# Altium schematic sheet Power supplies.SchDoc
size A4; Author: T. Kreppel; CompanyName: Universidad de Santiago de Chile; Address1: Avenida Ecuador Nº 3519; Address2: Estación Central, Santiago; Address3: Chile; DocumentNumber: 5; SheetNumber: 5; SheetTotal: 5
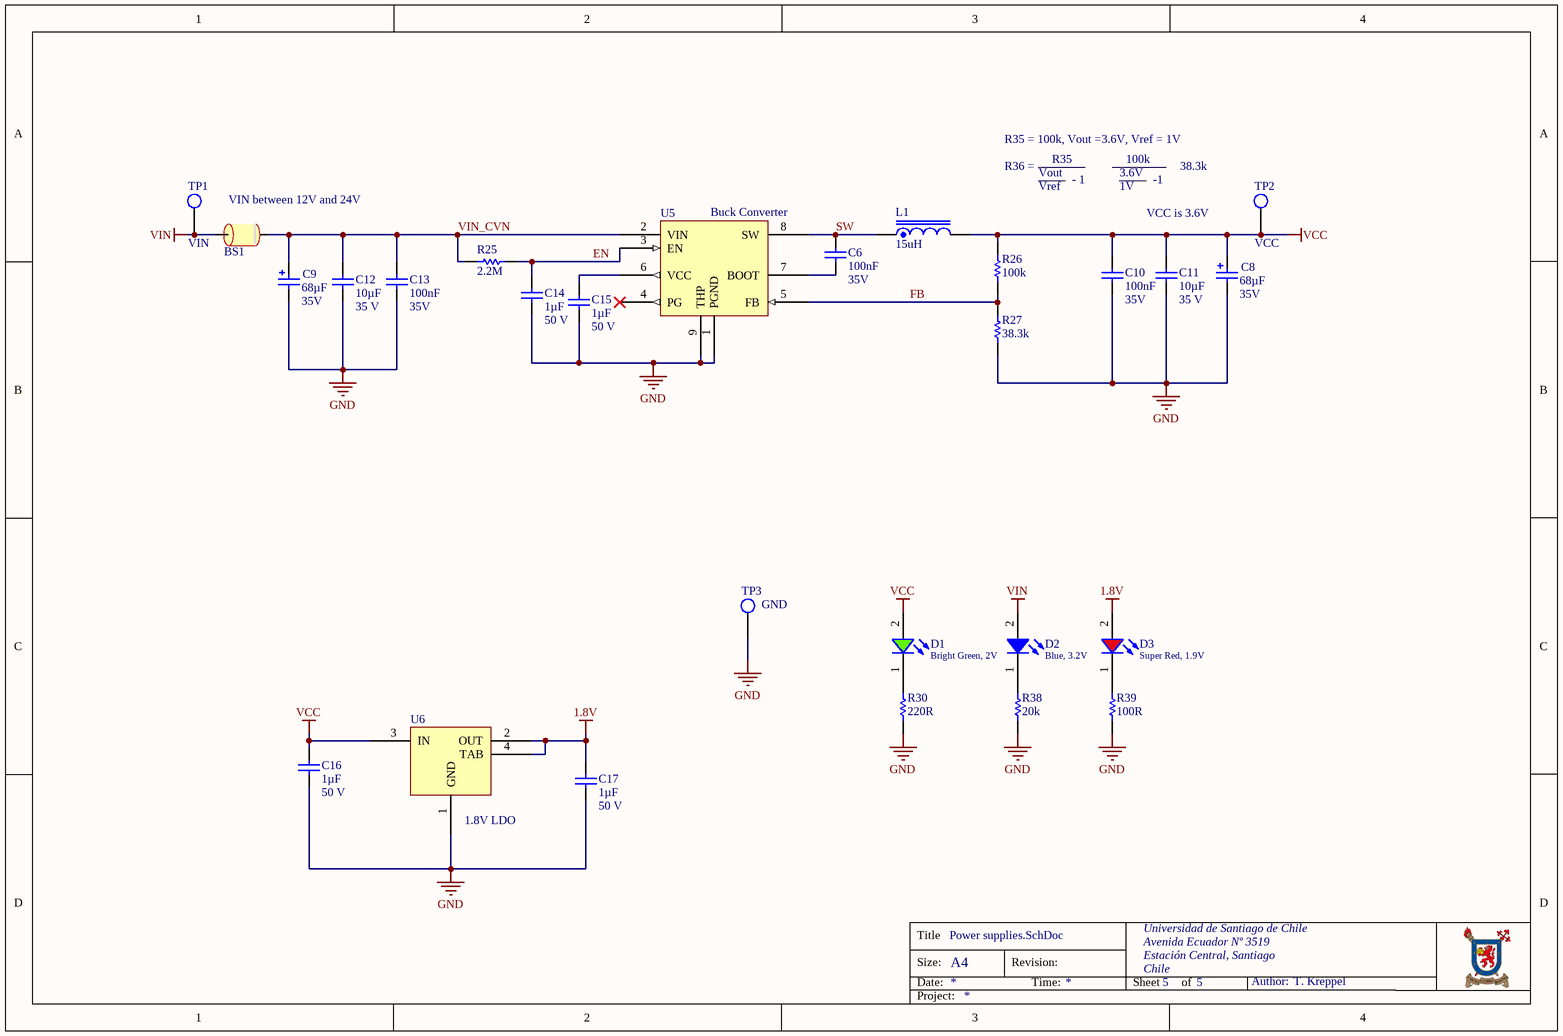
[diagram p0: Power supplies.SchDoc]

## Parts
BS1  Ferrite bead  [RES_1206]  (value not drawn)
C6  100nF  Voltage: 35V  [CAP_0603]
C8  68µF  Voltage: 35V  [WCAP-ATG8_6.3x11]
C9  68µF  Voltage: 35V  [WCAP-ATG8_6.3x11]
C10  100nF  Voltage: 35V  [CAP_0603]
C11  10µF  Voltage: 35 V  [RES_1206]
C12  10µF  Voltage: 35 V  [RES_1206]
C13  100nF  Voltage: 35V  [CAP_0603]
C14  1µF  Voltage: 50 V  [CAP_0603]
C15  1µF  Voltage: 50 V  [CAP_0603]
C16  1µF  Voltage: 50 V  [CAP_0603]
C17  1µF  Voltage: 50 V  [CAP_0603]
D1  Bright Green, 2V  [WL-SMCW_0603_H=0.7mm]
D2  Blue, 3.2V  [WL-SMCW_0603_H=0.7mm]
D3  Super Red, 1.9V  [WL-SMCW_0603_H=0.7mm]
L1  15uH  [SMT_inductor_1050_Performance]
R25  2.2M  [RES_0603]
R26  100k  [RES_0603]
R27  38.3k  [RES_0603]
R30  220R  [RES_0603]
R38  20k  [RES_0603]
R39  100R  [RES_0603]
TP1  VIN  [TP_1.6mm]  (no BOM)
TP2  VCC  [TP_1.6mm]  (no BOM)
TP3  GND  [TP_1.6mm]  (no BOM)
U5  Buck Converter  [SOIC127P600X170_HS-9N]
U6  1.8V LDO  [SOT230P700X170-4N]

## Nets
1.8V: C17.1 D3.2(A) U6.2(OUT) U6.4(TAB)
GND: C8.1(N) C9.1(N) C10.2 C11.2 C12.2 C13.2 C14.2 C15.2 C16.2 C17.2 R27.1 R30.1 R38.2 R39.2 TP3.1 U5.1(PGND) U5.9(THP) U6.1(GND)
VCC: C8.2(P) C10.1 C11.1 C16.1 D1.2(A) L1.2 R26.2 TP2.1 U6.3(IN)
VIN: BS1.1 D2.2(A) TP1.1
EN: C14.1 R25.1 U5.3(EN)
FB: R26.1 R27.2 U5.5(FB)
SW: C6.1 L1.1 U5.8(SW)
VIN_CVN: BS1.2 C9.2(P) C12.1 C13.1 R25.2 U5.2(VIN)
NetC6_2: C6.2 U5.7(BOOT)
NetC15_1: C15.1 U5.6(VCC)
NetD1_1: D1.1(K) R30.2
NetD2_1: D2.1(K) R38.1
NetD3_1: D3.1(K) R39.1

Not connected (* = marked no-connect by the designer): U5 4(PG)*

## Notes on the sheet
- R35 = 100k, Vout =3.6V, Vref = 1V
- R36 =
- Vout
- R35
- 3.6V
- 100k
- 38.3k
- VIN between 12V and 24V
- Vref
- - 1
- 1V
- VCC is 3.6V
- -1
- Title
- Size:
- Date:
- A4
- Revision:
- Time:
- Sheet
- of
- Author:
- Project:

## Library data of the parts
BS1 = Bead: 6A; MPN: 742792121; MF: Würth Elektronik; DCR: 60mOhm; I_r: 3A; Supplier 1: Digikey; Supplier Part Number 1: 732-4654-1-ND; Package: 1206; LCSC Part Number: C5271178
C6 = Cap_0603: Capacitor; MPN: C0603C104M5RACTU; Rule: PcbType=ProtelPcb; MF: KEMET; Dielectricum: X7R; Tolerance: 10%; Published: 8-Jun-2000; LatestRevisionDate: 17-Jul-2002; LatestRevisionNote: Re-released for DXP Platform.; PackageReference: RAD-0.3; Publisher: Altium Limited; Value: 100nF; Supplier 1: Digikey; Supplier 2: Mouser; Supplier Part Number 1: 399-7845-1-ND; Package: 0603; LCSC Part Number: C14663
C8 C9 = 860010573006: WCAP-ATG8 THT Aluminum Electrolytic Capacitors, D6.3mm x L11mm, 68uF, +/-20%, 35VDC; Dissipation Factor: 12%; Endurance: 2000h; Leakage Current: 23.8uA; Ripple Current max.: 198mA; Technical Reference: ATBD110680M035DSPA4B000; ComponentLink1Description: Manufacturer; ComponentLink1URL: http://www.we-online.de; ComponentLink2Description: Datasheet; ComponentLink2URL: https://katalog.we-online.com/pbs/datasheet/860010573006.pdf; Length: 11mm; Mounting Technology: THT; Operating Temperature: -40 to +85degC; Packaging: Ammo Pack; Published Date: August 2019; Value: 68µF; Diameter: 6.3mm; Part Number: 860010573006; Publisher: Wurth Elektronik; Tolerance: +/-20%; Supplier 1: Digikey; Supplier Part Number 1: 732-8736-1-ND; LCSC Part Number: C1668506
C10 C13 = Cap_0603: Capacitor; MPN: C0603C104M5RACTU; Rule: PcbType=ProtelPcb; MF: KEMET; Tolerance: 10%; Dielectricum: X7R; Published: 8-Jun-2000; LatestRevisionDate: 17-Jul-2002; LatestRevisionNote: Re-released for DXP Platform.; PackageReference: RAD-0.3; Publisher: Altium Limited; Value: 100nF; Supplier 1: Digikey; Supplier Part Number 1: 399-7845-1-ND; Package: 0603; LCSC Part Number: C14663
C11 C12 = Cap_1206: Capacitor; MPN: GRM319R6YA106KA12D; Dielectricum: X7R; Tolerance: 10%; Value: 10µF; Supplier 1: Digikey; Supplier Part Number 1: 490-9964-1-ND; MF: *; Package: 1206; LCSC Part Number: C123678
C14 C16 C17 = Cap_0603: Capacitor Ceramic; MPN: C0603C105K3RACTU; MF: KEMET; Tolerance: 10%; Dielectricum: X7R; Value: 1µF; Supplier 1: Digikey; Supplier Part Number 1: 399-7376-1-ND; Package: 0603; LCSC Part Number: C2177372
C15 = Cap_0603: Capacitor Ceramic; MPN: C0603C105K3RACTU; MF: KEMET; Dielectricum: X7R; Tolerance: 10%; Value: 1µF; Supplier 1: Digikey; Supplier Part Number 1: 399-7376-1-ND; Package: 0603; LCSC Part Number: C2177372
D1 = 150060VS75000: WL-SMCW SMT Mono-color Chip LED Waterclear, size 0603, Bright Green, 2V, 140deg; Chip Technology: AlInGaP; Dominant Wavelength typ.: 570nm; Luminous Intensity typ.: 40mcd; Peak Wavelength typ.: 572nm; MF: Wurth Elektronik; Viewing Angle: 140deg; ComponentLink1Description: Manufacturer; ComponentLink1URL: http://www.we-online.de; ComponentLink2URL: https://www.we-online.com/catalog/datasheet/150060VS75000.pdf; ComponentLink2Description: Datasheet; Forward Voltage typ.: 2V; Emitting Color: Bright Green; Mounting Technology: SMT; Operating Temperature: -40 to +85degC; Published Date: December 2019; MPN: 150060VS75000; Packaging: Tape and Reel; Size: 0603; Supplier 1: Digikey; Supplier Part Number 1: 732-4980-1-ND; Package: 0603
D2 = 150060BS75000: WL-SMCW SMT Mono-color Chip LED Waterclear, size 0603, Blue, 3.2V, 140deg; Chip Technology: InGaN; Dominant Wavelength typ.: 470nm; Luminous Intensity typ.: 145mcd; Peak Wavelength typ.: 465nm; MF: Wurth Elektronik; Viewing Angle: 140deg; ComponentLink1Description: Manufacturer; ComponentLink1URL: http://www.we-online.de; ComponentLink2URL: https://www.we-online.com/catalog/datasheet/150060BS75000.pdf; ComponentLink2Description: Datasheet; Forward Voltage typ.: 3.2V; Emitting Color: Blue; Mounting Technology: SMT; Operating Temperature: -40 to +85degC; Published Date: December 2019; MPN: 150060BS75000; Packaging: Tape and Reel; Size: 0603; Supplier 1: Digikey; Supplier Part Number 1: 732-4966-1-ND; Package: 0603
D3 = 150060SS75000: WL-SMCW SMT Mono-color Chip LED Waterclear, size 0603, Super Red, 1.9V, 140deg; Chip Technology: AlInGaP; Dominant Wavelength typ.: 630nm; Luminous Intensity typ.: 60mcd; Peak Wavelength typ.: 645nm; MF: Wurth Elektronik; Viewing Angle: 140deg; ComponentLink1Description: Manufacturer; ComponentLink1URL: http://www.we-online.de; ComponentLink2URL: https://www.we-online.com/catalog/datasheet/150060SS75000.pdf; ComponentLink2Description: Datasheet; Forward Voltage typ.: 1.9V; Emitting Color: Super Red; Mounting Technology: SMT; Operating Temperature: -40 to +85degC; Published Date: December 2019; MPN: 150060SS75000; Packaging: Tape and Reel; Size: 0603; Supplier 1: Digikey; Supplier Part Number 1: 732-4979-1-ND; Package: 0603
L1 = B82464G4154M: SMT power Inductor, 15uH, 40m DRC; Rated Current: 3.7 A; MF: Murata; Supplier 1: Digikey; Supplier Part Number 1: 811-3837-1-ND; Value: 15uH; DCR: 40m; Supplier 2: Mouser; LCSC Part Number: C6818993
R25 = Res0603: MPN: RC0603FR-072M2L; MF: Yageo; Tolerance: 1%; Published: 8-Jun-2000; LatestRevisionDate: 17-Jul-2002; LatestRevisionNote: Re-released for DXP Platform.; PackageReference: AXIAL-0.3; Publisher: Altium Limited; PackageDescription: Axial Device, Thru-Hole; 2 Leads; 0.3 in Pin Spacing; Value: 2.2M; Supplier 1: Digikey; Supplier Part Number 1: YAG3329CT-ND; Package: 0603
R26 = Res0603: MPN: RC0603FR-07100KL; MF: Yageo; Tolerance: 1%; Published: 8-Jun-2000; LatestRevisionDate: 17-Jul-2002; LatestRevisionNote: Re-released for DXP Platform.; PackageReference: AXIAL-0.3; Publisher: Altium Limited; PackageDescription: Axial Device, Thru-Hole; 2 Leads; 0.3 in Pin Spacing; Value: 100k; Supplier 1: Digikey; Supplier Part Number 1: 311-100KHRCT-ND; Package: 0603
R27 R39 = Res0603: Tolerance: 1%; Published: 8-Jun-2000; LatestRevisionDate: 17-Jul-2002; LatestRevisionNote: Re-released for DXP Platform.; PackageReference: AXIAL-0.3; Publisher: Altium Limited; PackageDescription: Axial Device, Thru-Hole; 2 Leads; 0.3 in Pin Spacing; Supplier 1: Digikey; Package: 0603
  R27: Value: 38.3k; Supplier 2: Mouser; Supplier Part Number 1: 311-38.3KHRCT-ND
  R39: Value: 100R; Supplier Part Number 1: 311-100HRCT-ND; LCSC Part Number: C22775
R30 = Res0603: MPN: RC0603JR-07220RL; Tolerance: 1%; Published: 8-Jun-2000; LatestRevisionDate: 17-Jul-2002; LatestRevisionNote: Re-released for DXP Platform.; PackageReference: AXIAL-0.3; Publisher: Altium Limited; PackageDescription: Axial Device, Thru-Hole; 2 Leads; 0.3 in Pin Spacing; Value: 220R; Supplier 1: Digikey; Supplier 2: Mouser; Supplier Part Number 1: 311-220GRCT-ND; Package: 0603; LCSC Part Number: C1226
R38 = Res0603: MPN: RC0603FR-07330RL; Tolerance: 1%; Published: 8-Jun-2000; LatestRevisionDate: 17-Jul-2002; LatestRevisionNote: Re-released for DXP Platform.; PackageReference: AXIAL-0.3; Publisher: Altium Limited; PackageDescription: Axial Device, Thru-Hole; 2 Leads; 0.3 in Pin Spacing; Value: 20k; Supplier 1: Digikey; Supplier Part Number 1: 311-330HRCT-ND; Package: 0603; LCSC Part Number: C4184
TP1-TP3 = TP: 1.6mm Test Point Keystone; MPN: 5006; MF: Keystone Electronics; Created: 2020_04_Kreppel; Supplier 1: Digikey; Supplier Part Number 1: 36-5006-ND
U5 = LMR33620A: 3.8V to 36V, 2A synchronous step-down converter; MPN: LMR33620ADDA; Switching frequency: 400kHz; MF: Texas Instruments; Created: 4/20 Kreppel; Supplier 1: Digikey; Supplier Part Number 1: 296-48841-ND; Supplier 2: Mouser; LCSC Part Number: C2071694
U6 = TLV1117LV18DCYR: 1A Positive 1.8V Fixed-Voltage Low-Dropout Regulator; MF: Texas Instruments; Voltage Input Max: 5.5 V; Created: 2020_04_Kreppel; MPN: TLV1117LV18DCYR; Supplier 1: Digikey; Supplier Part Number 1: 296-28777-1-ND; Voltage Output: 1.8 V; Current Max: 1 A; Supplier 2: Mouser; Supplier Part Number 2: 595-TLV1117-18IDCYR; LCSC Part Number: C80105